# EAGLE schematic schema (EAGLE 6.5.0)
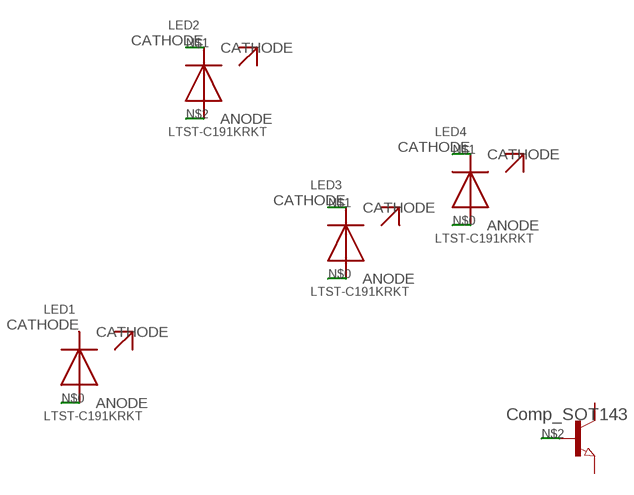
[diagram p0: schematic, sheet 1]

## Parts
Comp_SOT143  NPN-TRANSISTIOR-2COLSOT143  [SOT143]
LED1  LTST-C191KRKT  LED  [LED]
LED2  LTST-C191KRKT  LED  [LED]
LED3  LTST-C191KRKT  LED  [LED]
LED4  LTST-C191KRKT  LED  [LED]

## Nets
N$0: LED1.ANODE LED3.ANODE LED4.ANODE
N$1: LED2.CATHODE LED3.CATHODE LED4.CATHODE
N$2: Comp_SOT143.1(B) LED2.ANODE
Unconnected: Comp_SOT143.2(C) Comp_SOT143.3(E) Comp_SOT143.4(C/) LED1.CATHODE

## Library data of the parts
Comp_SOT143 = semicon-smd-ipc:NPN-TRANSISTIOR-2COL
LED1-LED4 = Andres_Project:LED